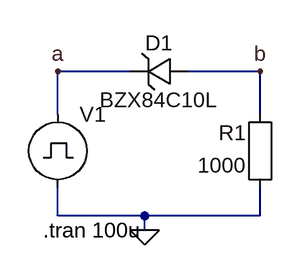
[diagram p0: schematic clipper_series.asc]
clipper_series.asc, the LTspice schematic file:
Version 4
SHEET 1 880 680
WIRE 32 176 -48 176
WIRE 176 176 96 176
WIRE -48 224 -48 176
WIRE 176 224 176 176
WIRE -48 336 -48 304
WIRE 48 336 -48 336
WIRE 176 336 176 304
WIRE 176 336 48 336
WIRE 48 352 48 336
FLAG -48 176 a
FLAG 48 352 0
FLAG 176 176 b
SYMBOL Misc\\EuropeanResistor 192 320 R180
WINDOW 0 31 76 Left 2
WINDOW 3 31 40 Left 2
SYMATTR InstName R1
SYMATTR Value 1000
SYMBOL zener 96 160 R90
WINDOW 0 0 32 VBottom 2
WINDOW 3 32 32 VTop 2
SYMATTR InstName D1
SYMATTR Value BZX84C10L
SYMATTR Description Diode
SYMATTR Type diode
SYMBOL pulse -48 208 R0
WINDOW 3 24 34 Invisible 2
WINDOW 123 0 0 Left 2
WINDOW 39 0 0 Left 2
SYMATTR Value PULSE(0 15 5u 1u 1u 20u 50u)
SYMATTR InstName V1
TEXT -64 352 Left 2 !.tran 100u

The netlist it stands for:
* clipper_series.asc
R1 0 b 1000
D1 b a BZX84C10L
V1 a 0 PULSE(0 15 5u 1u 1u 20u 50u)
.model D D
.lib standard.dio
.tran 100u
.backanno
.end